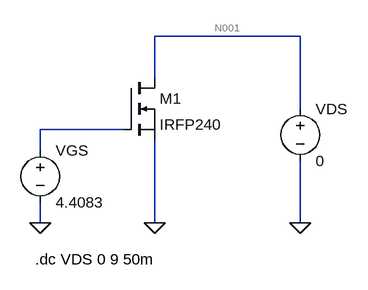
[diagram p0: schematic sim_mos.asc]
sim_mos.asc, the LTspice schematic file:
Version 4
SHEET 1 880 680
WIRE 448 64 224 64
WIRE 224 128 224 64
WIRE 448 176 448 64
WIRE 176 208 48 208
WIRE 48 240 48 208
WIRE 48 352 48 320
WIRE 224 352 224 224
WIRE 448 352 448 256
FLAG 448 352 0
FLAG 48 352 0
FLAG 224 352 0
SYMBOL nmos 176 128 R0
SYMATTR InstName M1
SYMATTR Value IRFP240
SYMBOL voltage 48 224 R0
WINDOW 123 0 0 Left 0
WINDOW 39 0 0 Left 0
SYMATTR InstName VGS
SYMATTR Value 4.4083
SYMBOL voltage 448 160 R0
WINDOW 123 0 0 Left 0
WINDOW 39 0 0 Left 0
SYMATTR InstName VDS
SYMATTR Value 0
TEXT 40 408 Left 2 !.dc VDS 0 9 50m

The netlist it stands for:
* sim_mos.asc
M1 N001 N002 0 0 IRFP240
VGS N002 0 4.4083
VDS N001 0 0
.model NMOS NMOS
.model PMOS PMOS
.lib standard.mos
.dc VDS 0 9 50m
.backanno
.end

* Results of the author's LTspice run, read from the files saved beside the schematic
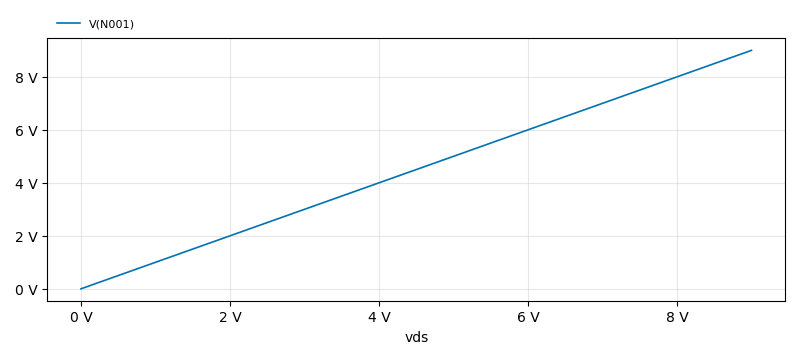
[diagram p1: DC transfer characteristic of sim_mos.asc, plotted from the saved traces]
* DC transfer characteristic, 1 run:
*   V(N001): 0 V at vds=0 V, 9 V at vds=9 V, min 0 V, max 9 V